# EAGLE design remoteserialcontroller (EAGLE 9.5.2)
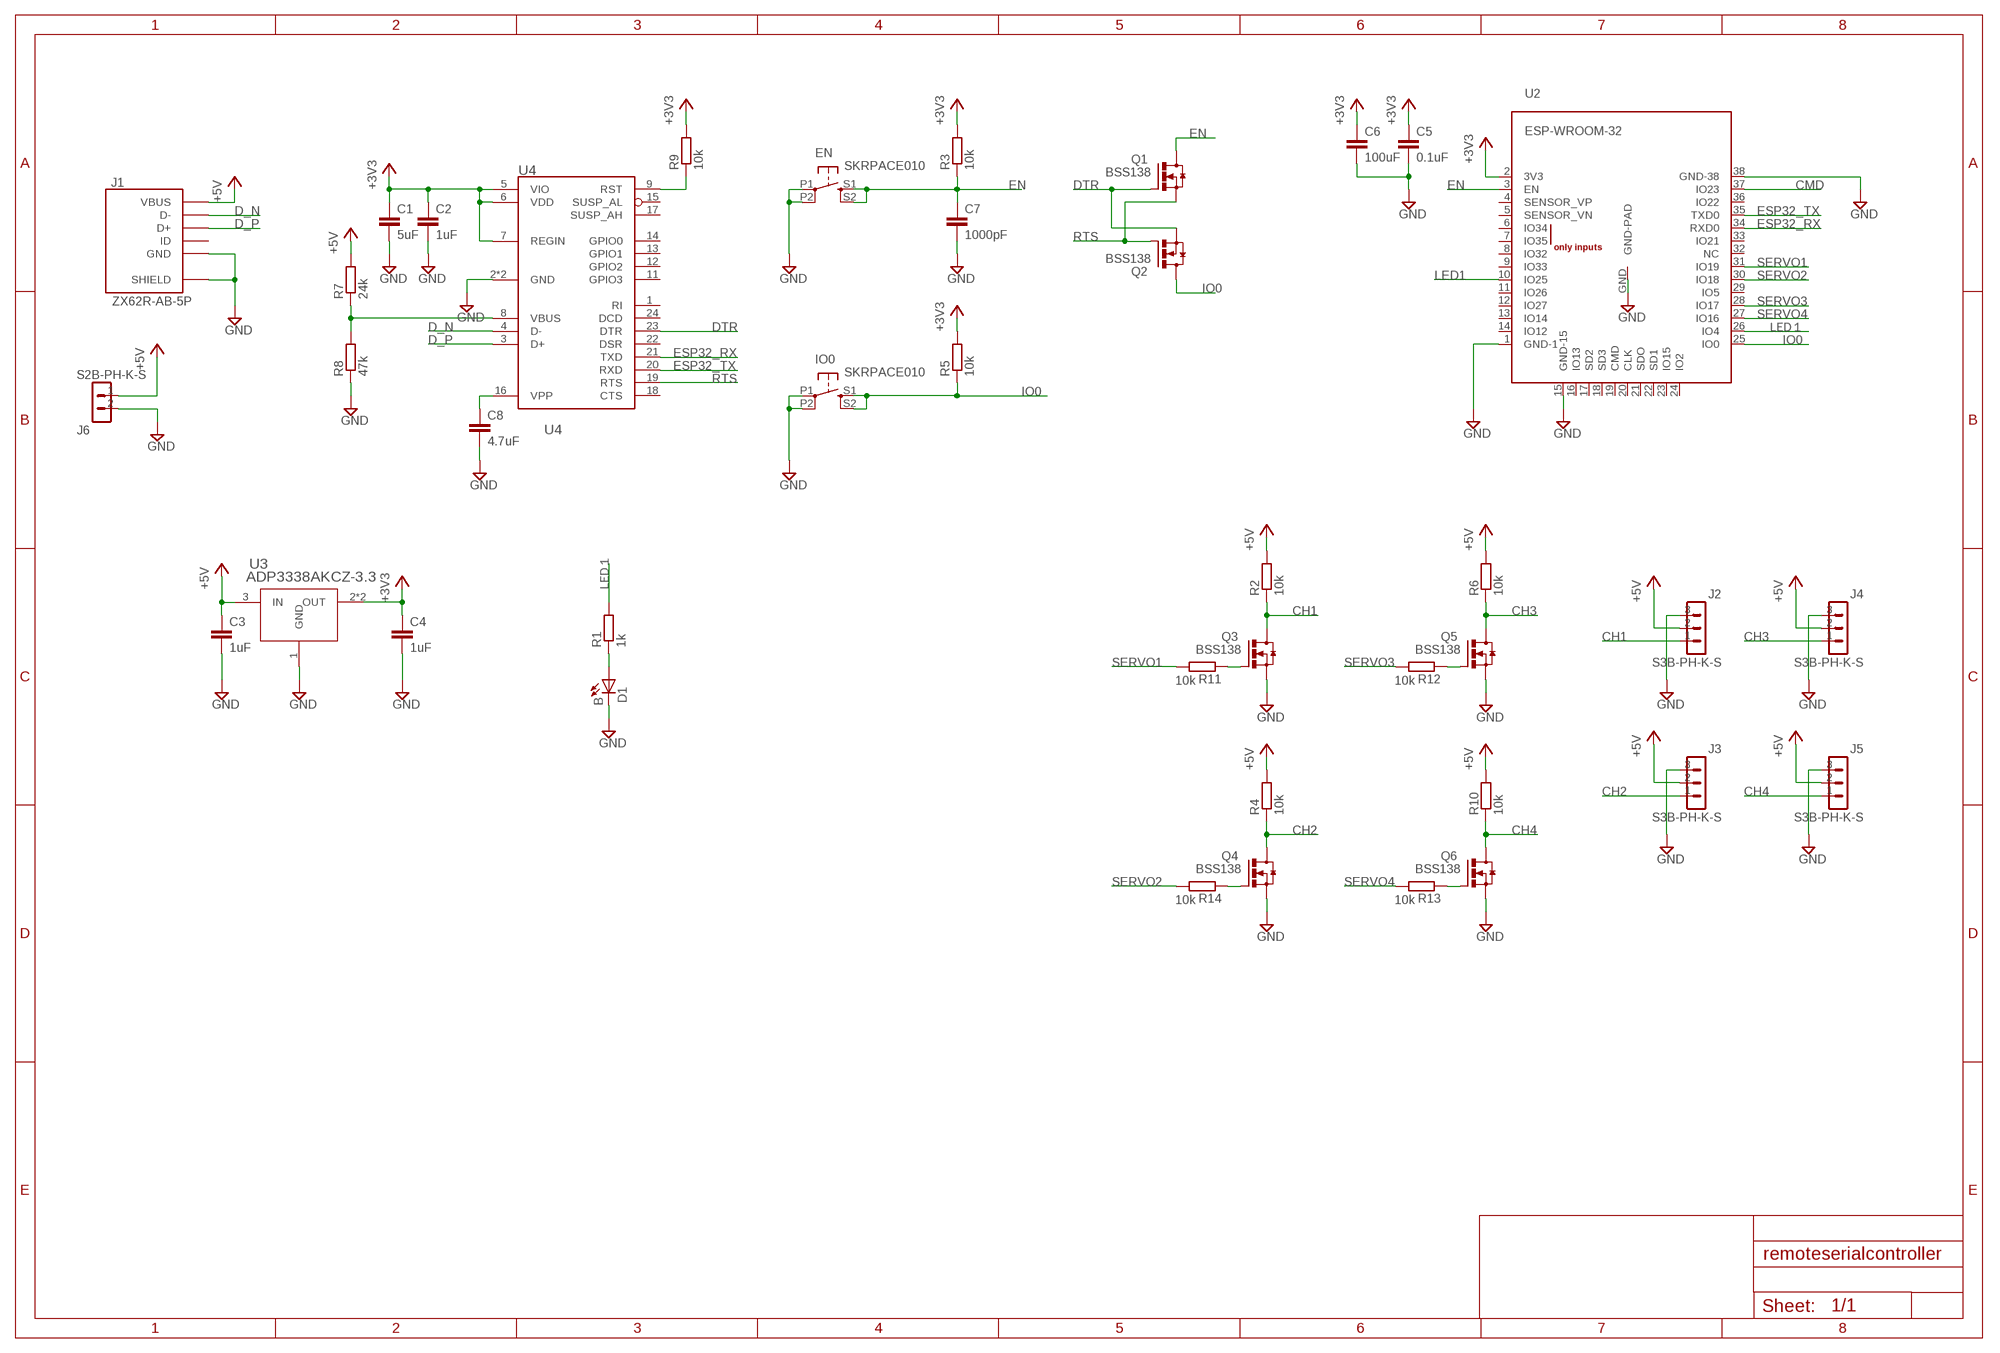
[diagram p0: schematic, sheet 1]

## Parts
C1  5uF  C-EUC0603  [C0603]
C2  1uF  C-EUC0603  [C0603]
C3  1uF  C-EUC0603  [C0603]
C4  1uF  C-EUC0603  [C0603]
C5  0.1uF  C-EUC0603  [C0603]
C6  100uF  C-EUC1210  [C1210]
C7  1000pF  C-EUC0603  [C0603]
C8  4.7uF  C-EUC0603  [C0603]
D1  B  LEDCHIPLED_0603  [CHIPLED_0603]
EN  SKRPACE010  [SKRPACE010]
IO0  SKRPACE010  [SKRPACE010]
J1  ZX62R-AB-5P  [ZX62R-B-5PA]
J2  S3B-PH-K-S  [S3B-PH-K-S]
J3  S3B-PH-K-S  [S3B-PH-K-S]
J4  S3B-PH-K-S  [S3B-PH-K-S]
J5  S3B-PH-K-S  [S3B-PH-K-S]
J6  S2B-PH-K-S  [S2B-PH-K-S]
Q1  BSS138  [SOT23-N-MOSFET]
Q2  BSS138  [SOT23-N-MOSFET]
Q3  BSS138  [SOT23-N-MOSFET]
Q4  BSS138  [SOT23-N-MOSFET]
Q5  BSS138  [SOT23-N-MOSFET]
Q6  BSS138  [SOT23-N-MOSFET]
R1  1k  R-EU_R0603  [R0603]
R2  10k  R-EU_R0603  [R0603]
R3  10k  R-EU_R0603  [R0603]
R4  10k  R-EU_R0603  [R0603]
R5  10k  R-EU_R0603  [R0603]
R6  10k  R-EU_R0603  [R0603]
R7  24k  R-EU_R0603  [R0603]
R8  47k  R-EU_R0603  [R0603]
R9  10k  R-EU_R0603  [R0603]
R10  10k  R-EU_R0603  [R0603]
R11  10k  R-EU_R0603  [R0603]
R12  10k  R-EU_R0603  [R0603]
R13  10k  R-EU_R0603  [R0603]
R14  10k  R-EU_R0603  [R0603]
U2  ESP-WROOM-32  [ESP-WROOM-32]
U3  ADP3338AKCZ-3.3  [SOT233]
U4  CP2104  [QFN24-SILABS]

## Nets
+3V3 [POWER]: C1.1 C2.1 C4.1 C5.1 C6.1 R3.2 R5.2 R9.2 U2.2(3V3) U3.2(OUT) U3.4(OUT) U4.5(VIO) U4.6(VDD) U4.7(REGIN)
+5V: C3.1 J1.VCC(VBUS) J2.2 J3.2 J4.2 J5.2 J6.1 R2.2 R4.2 R6.2 R7.2 R10.2 U3.3(IN)
CH1: J2.1 Q3.D R2.1
CH2: J3.1 Q4.D R4.1
CH3: J4.1 Q5.D R6.1
CH4: J5.1 Q6.D R10.1
CMD: U2.37(IO23)
D_N: J1.D- U4.4(D-)
D_P: J1.D+ U4.3(D+)
DTR: Q1.G Q2.S U4.23(DTR)
EN: C7.1 EN.S1(S) EN.S2(S1) Q1.D R3.1 U2.3(EN)
ESP32_RX: U2.34(RXD0) U4.21(TXD)
ESP32_TX: U2.35(TXD0) U4.20(RXD)
GND: C1.2 C2.2 C3.2 C4.2 C5.2 C6.2 C7.2 C8.2 D1.C EN.P1(P) EN.P2(P1) IO0.P1(P) IO0.P2(P1) J1.GND J1.SHIELD@1(SHIELD) J1.SHIELD@2(SHIELD) J1.SHIELD@3(SHIELD) J1.SHIELD@4(SHIELD) J2.3 J3.3 J4.3 J5.3 J6.2 Q3.S Q4.S Q5.S Q6.S R8.1 U2.1(GND-1) U2.15(GND-15) U2.38(GND-38) U2.GND(GND-PAD) U3.1(GND) U4.2(GND) U4.25(GND)
IO0: IO0.S1(S) IO0.S2(S1) Q2.D R5.1 U2.25(IO0)
LED1: U2.10(IO25)
LED１: R1.2 U2.26(IO4)
N$1: Q3.G R11.1
N$2: Q5.G R12.1
N$3: Q6.G R13.1
N$4: Q4.G R14.1
N$7: R9.1 U4.9(RST)
N$8: R7.1 R8.2 U4.8(VBUS)
N$9: C8.1 U4.16(VPP)
N$94: D1.A R1.1
RTS: Q1.S Q2.G U4.19(RTS)
SERVO1: R11.2 U2.31(IO19)
SERVO2: R14.2 U2.30(IO18)
SERVO3: R12.2 U2.28(IO17)
SERVO4: R13.2 U2.27(IO16)
Unconnected: J1.ID U2.4(SENSOR_VP) U2.5(SENSOR_VN) U2.6(IO34) U2.7(IO35) U2.8(IO32) U2.9(IO33) U2.11(IO26) U2.12(IO27) U2.13(IO14) U2.14(IO12) U2.16(IO13) U2.17(SD2) U2.18(SD3) U2.19(CMD) U2.20(CLK) U2.21(SDO) U2.22(SD1) U2.23(IO15) U2.24(IO2) U2.29(IO5) U2.32(NC) U2.33(IO21) U2.36(IO22) U4.1(RI) U4.11(GPIO3) U4.12(GPIO2) U4.13(GPIO1) U4.14(GPIO0) U4.15(SUSP_AL) U4.17(SUSP_AH) U4.18(CTS) U4.22(DSR) U4.24(DCD)

## Library data of the parts
C1-C8 = taki-library:C-EU: CAPACITOR, European symbol
D1 = taki-library:LED: LED OSRAM: - CHIPLED LG R971, LG N971, LY N971, LG Q971, LY Q971, LO R971, LY R971 LH N974, LH R974 LS Q976, LO Q976, LY Q976 LO Q996 - Hyper CHIPLED LW Q18S LB Q993, LB Q99A, LB R99A - SideLED LS A670, LO A670, LY A670, LG A670, LP A670 LB A673, LV A673, LT A673, LW A673 LH A674 LY A675 LS A676, LA A676, LO A676, LY A676, LW A676 LS A679, LY A679, LG A679 - Hyper Micro SIDELED® LS Y876, LA Y876, LO Y876, LY Y876 LT Y87S - SmartLED LW L88C, LW L88S LB L89C, LB L89S, LG L890 LS L89K, LO L89K, LY L89K LS L896, LA L896, LO L896, LY L896 - TOPLED LS T670, LO T670, LY T670, LG T670, LP T670 LSG T670, LSP T670, LSY T670, LOP T670, LYG T670 LG T671, LOG T671, LSG T671 LB T673, LV T673, LT T673, LW T673 LH T674 LS T676, LA T676, LO T676, LY T676, LB T676, LH T676, LSB T676, LW T676 LB T67C, LV T67C, LT T67C, LS T67K, LO T67K, LY T67K, LW E67C LS E67B, LA E67B, LO E67B, LY E67B, LB E67C, LV E67C, LT E67C LW T67C LS T679, LY T679, LG T679 LS T770, LO T770, LY T770, LG T770, LP T770 LB T773, LV T773, LT T773, LW T773 LH T774 LS E675, LA E675, LY E675, LS T675 LS T776, LA T776, LO T776, LY T776, LB T776 LHGB T686 LT T68C, LB T68C - Hyper Mini TOPLED® LB M676 - Mini TOPLED Santana® LG M470 LS M47K, LO M47K, LY M47K Source: http://www.osram.convergy.de LUXEON: - LUMILED® LXK2-PW12-R00, LXK2-PW12-S00, LXK2-PW14-U00, LXK2-PW14-V00 LXK2-PM12-R00, LXK2-PM12-S00, LXK2-PM14-U00 LXK2-PE12-Q00, LXK2-PE12-R00, LXK2-PE12-S00, LXK2-PE14-T00, LXK2-PE14-U00 LXK2-PB12-K00, LXK2-PB12-L00, LXK2-PB12-M00, LXK2-PB14-N00, LXK2-PB14-P00, LXK2-PB14-Q00 LXK2-PR12-L00, LXK2-PR12-M00, LXK2-PR14-Q00, LXK2-PR14-R00 LXK2-PD12-Q00, LXK2-PD12-R00, LXK2-PD12-S00 LXK2-PH12-R00, LXK2-PH12-S00 LXK2-PL12-P00, LXK2-PL12-Q00, LXK2-PL12-R00 Source: www.luxeon.com KINGBRIGHT: KA-3528ASYC Source: www.kingbright.com
EN IO0 = taki-library:SKRPACE010
J1 = taki-library:ZX62
J2-J5 = taki-library:S3B-PH-K-S
J6 = taki-library:S2B-PH-K-S
Q1-Q6 = taki-library:BSS138
R1-R14 = taki-library:R-EU_: RESISTOR, European symbol
U2 = taki-library:ESP-WROOM-32
U3 = taki-library:ADP3338AKCZ-3.3
U4 = taki-library:CP2104

## Net classes
0 default: width 0.152 mm
1 POWER: width 0.254 mm

## Board
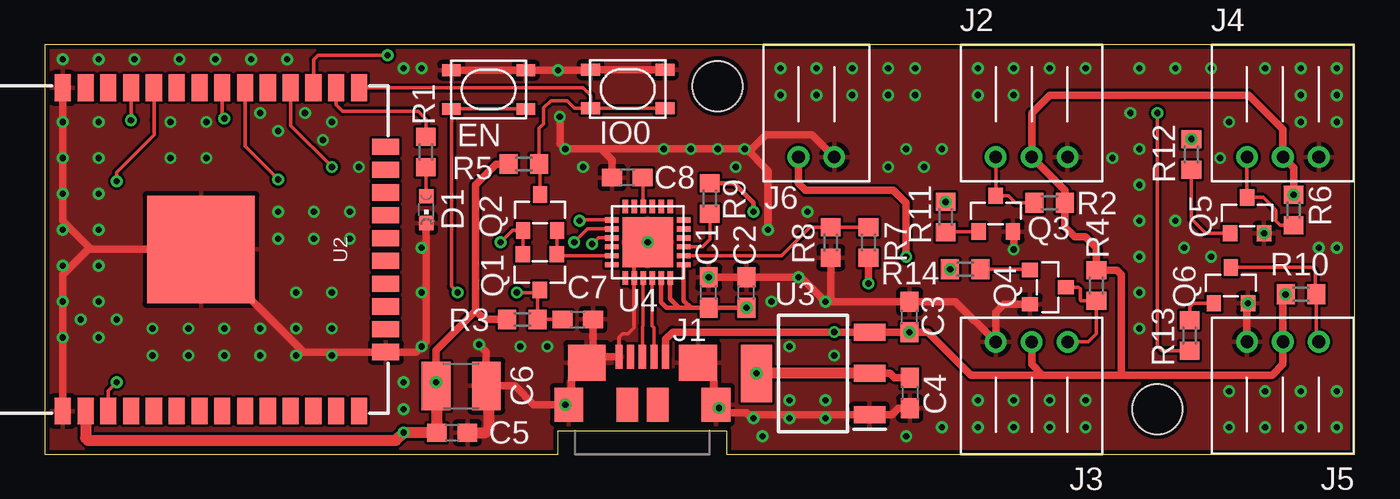
[diagram p1: board, top side]
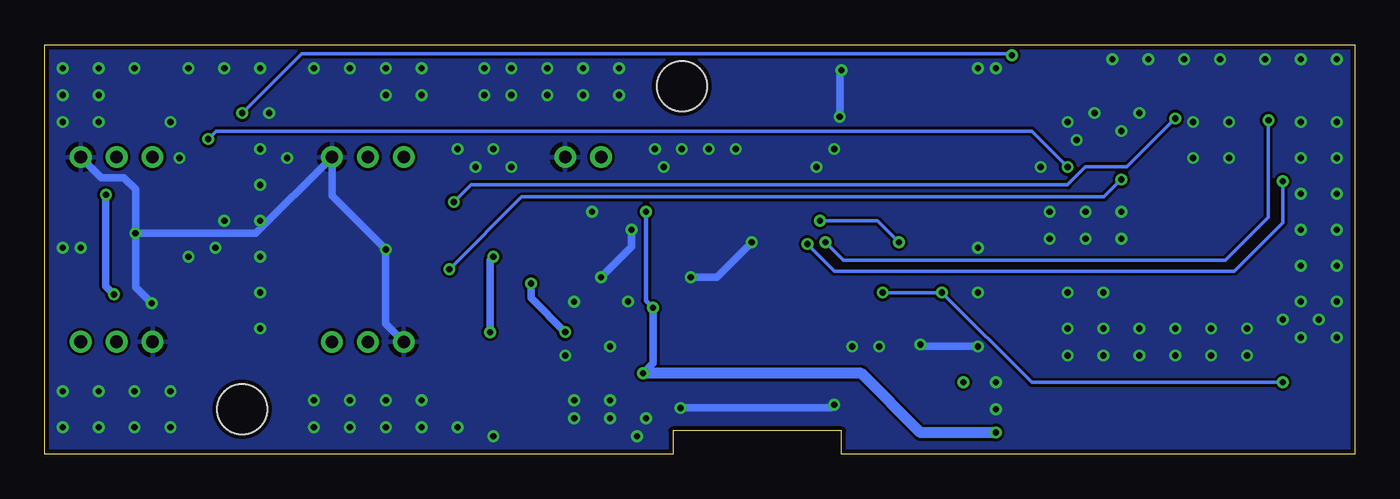
[diagram p2: board, bottom side, seen from below]

Size 73 x 22.8 mm. Coordinates in mm from the lower left corner, seen from the top.
Outline: 0,0 28.6,0 28.6,1.3 38,1.3 38,0 73,0 73,22.8 0,22.8 0,0
Copper layers (1*16): Top 0.035mm / dielectric 1.5mm / Bottom 0.035mm
Design rules "Elecrow_2-layer_eagle_rule": minimum track width 6mil, minimum drill 12mil, track to track 6mil, track to pad 6mil, pad to pad 6mil, via to via 6mil, smd to smd 0mil, copper to edge 10mil, drill to drill 10mil, minimum pad ring 10mil, minimum via ring 6mil, stop-mask expansion 2mil, vias tented up to drill 100mil, thermal gap 10mil
Holes 2.8 mm at 37.5,20.5 62,2.5

### Footprints (pad centres in the part's own frame; a part is rotated, then mirrored left to right if it is on the bottom)
C0603 = smd 1.1 x 1: 1 -0.85,0; 2 0.85,0
C1210 = smd 1.6 x 2.7: 1 -1.4,0; 2 1.4,0
CHIPLED_0603 = smd 0.8 x 0.8: A 0,-0.75; C 0,0.75
SKRPACE010 = smd 1.05 x 0.65: P1 -2.075,-1.075; P2 2.075,-1.075; S1 -2.075,1.075; S2 2.075,1.075
ZX62R-B-5PA = smd 0.4 x 1.35: D+ 0,2.675; D- 0.65,2.675; GND -1.3,2.675; ID -0.65,2.675; VCC 1.3,2.675 | smd 1.2 x 1.9: NC@1 -0.85,0; NC@2 0.85,0 | smd 2.1 x 2: SHIELD@1 -3.1,2.35; SHIELD@2 3.1,2.35 | smd 1.6 x 1.9: SHIELD@3 -4.1,0; SHIELD@4 4.1,0
S3B-PH-K-S = drill 0.7: 1 -2,0; 2 0,0; 3 2,0
S2B-PH-K-S = drill 0.7: 1 -1,0; 2 1,0
SOT23-N-MOSFET = smd 0.8 x 0.9: D 0,1; G -0.95,-1; S 0.95,-1
R0603 = smd 1 x 1.1: 1 -0.85,0; 2 0.85,0
ESP-WROOM-32 = smd 0.9 x 1.5: 1 7.7,9; 2 6.43,9; 3 5.16,9; 4 3.89,9; 5 2.62,9; 6 1.35,9; 7 0.08,9; 8 -1.19,9; 9 -2.46,9; 10 -3.73,9; 11 -5,9; 12 -6.27,9; 13 -7.54,9; 14 -8.81,9; 25 -8.81,-9; 26 -7.54,-9; 27 -6.27,-9; 28 -5,-9; 29 -3.73,-9; 30 -2.46,-9; 31 -1.19,-9; 32 0.08,-9; 33 1.35,-9; 34 2.62,-9; 35 3.89,-9; 36 5.16,-9; 37 6.43,-9; 38 7.7,-9 | smd 1.5 x 0.9: 15 -10.3,5.715; 16 -10.3,4.445; 17 -10.3,3.175; 18 -10.3,1.905; 19 -10.3,0.635; 20 -10.3,-0.635; 21 -10.3,-1.905; 22 -10.3,-3.175; 23 -10.3,-4.445; 24 -10.3,-5.715 | smd 6 x 6: GND 0,0
SOT233 = smd 1.75 x 0.95: 1 -3.15,2.3; 2 -3.15,0; 3 -3.15,-2.3 | smd 1.75 x 3.2: 4 3.15,0
QFN24-SILABS = smd 0.75 x 0.3: 1 -2,1.25; 2 -2,0.75; 3 -2,0.25; 4 -2,-0.25; 5 -2,-0.75; 6 -2,-1.25; 13 2,-1.25; 14 2,-0.75; 15 2,-0.25; 16 2,0.25; 17 2,0.75; 18 2,1.25 | smd 0.3 x 0.75: 7 -1.25,-2; 8 -0.75,-2; 9 -0.25,-2; 10 0.25,-2; 11 0.75,-2; 12 1.25,-2; 19 1.25,2; 20 0.75,2; 21 0.25,2; 22 -0.25,2; 23 -0.75,2; 24 -1.25,2 | smd 2.8 x 2.8: 25 0,0

### Placement (x,y rotation side)
C1  37,9 90 top
C2  39.1,9 90 top
C3  48.19,7.64 90 top
C4  48.21,3.41 270 top
C5  22.7,1.2 0 top
C6  23.2,3.8 0 top
C7  29.7,7.5 0 top
C8  32.46,15.41 180 top
D1  21.26,13.62 180 top
EN  24.73,20.31 180 top
IO0  32.49,20.34 180 top
J1  33.3,2.75 0 top
J2  55,16.55 0 top
J3  55,6.25 180 top
J4  69,16.55 0 top
J5  69,6.26 180 top
J6  43,16.55 0 top
Q1  27.59,10.14 180 top
Q2  27.6,13.46 0 top
Q3  53,13.4 0 top
Q4  55.9,9.3 270 top
Q5  67,13.3 0 top
Q6  66.1,9.4 0 top
R1  21.24,16.84 90 top
R2  56,14 0 top
R3  26.6,7.5 180 top
R4  58.6,9.4 90 top
R5  26.7,16.16 180 top
R6  69.6,13.6 90 top
R7  45.9,11.8 270 top
R8  43.8,11.8 90 top
R9  37.06,14.24 90 top
R10  70,8.9 180 top
R11  50.2,13.2 90 top
R12  63.9,16.7 90 top
R13  63.8,6.6 270 top
R14  51.3,10.3 180 top
U2  8.7,11.4 180 top
U3  42.81,4.5 180 top
U4  33.6,11.8 90 top

### Tracks (layer width: path | path; a pad name or v marks a point on that pad's centre or on a via)
+3V3  (via drill 0.35)
  Top 0.254: U4.6 34.85,8.65 35.35,8.15 | 35.35,8.15 36,8.15 | 36,8.15 C1.1 C2.1 | U4.7 35.6,8.55 36,8.15 | U4.5 34.35,8.45 34.65,8.15 35.35,8.15 | R9.2 38.41,15.09 39.5,14 v39.5,13.5
  Top 0.406: U3.2 47.1,4.5 47.34,4.26 C4.1 | R3.2 24.5,7.5 24,8 | 24,8 24,15 25.16,16.16 R5.2 | v21.8,4 21.8,5.8 24,8
  Top 0.61: U2.2 2.27,0.91 2.41,0.76 19.56,0.76 v20,1.2 C5.1 21.85,3.85 C6.1 v21.8,4 | U3.2 U3.4
  Bottom 0.254: v39.5,13.5 39.5,8.55 C2.1
  Bottom 0.406: C2.1 39.1,5.06 U3.4
  Bottom 0.61: v20,1.2 24.2,1.2 27.5,4.5 U3.4
  other vias: 39.1,8.15 39.66,4.5
+5V  (via drill 0.35)
  Top 0.406: J1.VCC 34.6,6.4 35,6.8 v44,6.8 U3.3 C3.1 49.21,6.79 51.6,4.4 55.6,4.4 | v45.9,9.5 R7.2 | J6.1 42,15.1 42.4,14.7 47.3,14.7 48,14 v48,11 | R6.2 69.6,15.95 J4.2 69,18.1 67.1,20 56,20 55,19 J2.2 56.85,14.7 R2.2 56.85,12.65 57.4,12.1 58,12.1 58.6,11.5 R4.2 59.75,10.25 60,10 60,4.4 | R10.2 69,8.75 J5.2 69,5 68.4,4.4 60,4.4 | J3.2 55,5 55.6,4.4 | 55.6,4.4 60,4.4
  Bottom 0.406: v45.9,9.5 45.9,8.7 v44,6.8 | C3.1 48.19,10.81 v48,11 | R10.2 69.6,9.35 R6.2
  other vias: 48.19,6.79 69.15,8.9 69.6,14.45
CH1
  Top 0.203: J2.1 Q3.D 53.7,14.4 54.1,14 R2.1
CH2
  Top 0.203: Q4.D 57.6,9.3 57.7,9.2 57.7,8.6 57.75,8.55 R4.1 58.6,6.7 58.15,6.25 J3.1
CH3
  Top 0.203: Q5.D 67.05,14.25 | Q5.D J4.1 | 69.25,12.75 R6.1 68.85,12.75 68.6,13 68.6,13.6 67.9,14.3 Q5.D
CH4
  Top 0.203: J5.1 70.85,6.41 R10.1 70.8,8.95 70.8,10.2 70.6,10.4 Q6.D
D_N
  Top 0.203: U4.4 33.85,7.15 33.95,7.05 J1.D-
D_P
  Top 0.203: U4.3 33.35,7.15 33.3,7.1 J1.D+
DTR
  Top 0.203: U4.23 28.63,11.05 Q1.G Q2.S
EN  (via drill 0.35)
  Top 0.203: 27.45,9 R3.1 C7.1 | v4,4 3.54,3.54 U2.3 | Q1.D 27.45,9 | 27.45,9 v26.3,9 | EN.S1 EN.S2 22.66,9.35 v23,9
  Bottom 0.203: v4,4 18,4 v23,9 v26.3,9
ESP32_RX  (via drill 0.35)
  Top 0.203: U2.34 6.08,18.62 | 6.08,18.62 6.1,18.6 | 6.08,18.62 6.08,17.78 4,15.7 v4,15.2 | v30.5,11.7 30.85,12.05 U4.21
  Bottom 0.203: v4,15.2 4,12.9 6.7,10.2 29,10.2 v30.5,11.7
ESP32_TX  (via drill 0.35)
  Top 0.203: U4.20 30.25,12.55 v29.5,11.8 | v4.8,18.6 U2.35
  Bottom 0.203: v29.5,11.8 28.5,10.8 7.2,10.8 4.8,13.2 v4.8,18.6
GND  (via drill 0.35)
  Top 0.203: J1.GND 32,6.5 32.2,6.7 32.5,6.7 32.85,7.05 U4.2 32.85,11.05 U4.25 | 37.25,2 37.4,2.15 J1.SHIELD@4 v37.58,2.58
  Top 0.406: J1.SHIELD@1 30.05,4.95 29.47,4.95 29.35,4.83 29.35,2 | 37.25,2 37.25,4.83 37.13,4.95 36.55,4.95 J1.SHIELD@2 | J1.GND 30.52,5.42 J1.SHIELD@1 | v37.58,2.58 37.85,2.3 39.1,2.3 39.2,2.2 U3.1 47.2,2.2 47.56,2.56 C4.2 | C1.2 C2.2 v42,9.85 42.15,9.85 v43.51,8.49 | v43.51,8.49 C3.2 50.76,8.49 J3.3 53,7.9 53.45,8.35 Q4.S | R8.1 43.8,8.78 v43.51,8.49 | 22.62,21.41 EN.P2 EN.P1 v28.6,21.39 30.39,21.39 IO0.P2 IO0.P1 | C8.2 31.61,16.39 31,17 | 31,17 v29,17 28.7,17.3 v28.7,18.8 | J1.SHIELD@1 30.55,5.45 C7.2 | J1.SHIELD@3 v29,2.75 27.25,2.75 26.2,3.8 C6.2 24.6,5.7 v24.2,6.1 | J5.3 67,8.35 Q6.S | U2.38 1,13 2.5,11.5 | 2.5,11.5 2.6,11.4 U2.GND 14.41,5.68 U2.15 20.68,5.68 v21,6 21.26,6.26 D1.C | U2.1 1,10 2.5,11.5 | v40.3,12.5 40.3,15.8 39.1,17 | 31,17 39.1,17 | 39.1,17 39.4,17 40.2,17.8 42.75,17.8 J6.2 | Q3.S 54,12.35 v54,11.4
  Top 0.61: C5.2 24.57,1.2 24.77,1.4 24.77,3.73 C6.2
  Bottom 0.406: U4.25 35.55,9.85 C1.2 | v28.6,21.39 28.7,21.29 v28.7,18.8 | v37.58,2.58 29.18,2.58 v29,2.75 | Q6.S 67.95,9.3 Q5.S | J4.3 69.85,15.4 68.6,15.4 67.95,14.75 Q5.S | v24.2,6.1 24.1,6 v21,6 | v42,9.85 40.3,11.55 v40.3,12.5 | J3.3 54,7.25 v54,11.4 57,14.4 J2.3 61.25,12.3 Q5.S
  other vias: 33.6,11.8 37,9.85 67.05,8.4 67.95,12.3 1,18.5 1,16.5 3,16.5 3,18.5 1,14.5 3,14.5 1,12.5 3,12.5 1,10.5 3,10.5 1,8.5 3,8.5 2,7.5 4,7.5 1,6.5 3,6.5 7,18.5 9,18.5 9,16.5 7,16.5 6,7 8,7 6,5.5 8,5.5 10,7 10,5.5 12,5.5 12,7 14,7 14,5.5 13,13.5 13,12 15,12 15,13.5 17,13.5 17,12 16,7 16,5.5 14,9 16,9 21,9 21,11.5 30,16 34.5,17 36,17 37.5,17 39,17 41,21.5 41,20 43,21.5 43,20 45,21.5 45,20 47,21.5 47,20 48.5,21.5 48.5,20 52,21.5 52,20 54,21.5 54,20 56,21.5 58,21.5 61,21.5 63,21.5 65,21.5 68,21.5 70,21.5 70,20 72,21.5 72,20 72,18.5 70,18.5 66,18.5 72,11.5 71,11.5 63.5,11.5 63,13 61,17 61,15 61,13 61,11 61,9 61,7 70,3.5 70,1.5 68,1.5 68,3.5 66,3.5 66,1.5 72,1.5 72,3.5 58,3 58,1.5 56,1.5 56,3 54,3 54,1.5 52,1.5 52,3 50,1.5 41.5,3 43.5,3 43.5,2 41.5,2 39.5,2 40,1 48,1 41.5,6 44,5.5 40.5,8.5 42.5,13.5 38.5,16 47,16 49,16 48,17 50,17 20,21.5 21,21.5 13.5,22 11.5,22 9.5,22 7.5,22 5,22 3,22 1,22 12,19 13,18 14.5,19 16,18.5 15.5,17.5 17.5,16 20,4 20,2.5 26.5,6 28,6 60.5,19 59.5,16.5 65.5,16.5 65,11
  pour Top: 0,23 0,0 73,0 73,23
  pour Bottom: -0.5,23 -0.5,0 73,0 73,23
IO0
  Top 0.203: Q2.D 27.6,16.11 R5.1 | 27.57,16.18 R5.1 | IO0.S2 30.41,19.98 30,20.4 U2.25 | IO0.S2 IO0.S1 | R5.1 27.55,18.15 27.8,18.4 27.8,19.3 28.2,19.7 29.1,19.7 29.54,19.27 IO0.S2
LED１
  Top 0.203: R1.2 21.24,18.66 20.8,19.1 16.6,19.1 16.24,19.46 U2.26
N$1
  Top 0.203: Q3.G 50.25,12.4 R11.1
N$2
  Top 0.203: R12.1 63.9,13.1 64.7,12.3 Q5.G
N$3
  Top 0.203: R13.1 63.8,8.2 64,8.4 Q6.G
N$4
  Top 0.203: R14.1 54.85,10.3 Q4.G
N$7
  Top 0.203: U4.9 36.65,11.55 37.06,11.96 R9.1
N$8
  Top 0.203: R7.1 R8.2 42.65,12.65 41.05,11.05 U4.8
N$9
  Top 0.203: U4.16 33.35,15.35 C8.1
N$94
  Top 0.203: D1.A 21.24,14.39 R1.1
RTS  (via drill 0.35)
  Top 0.203: U4.19 29.85,13.05 v29.8,13 | v25.4,11.8 26.06,12.46 Q2.G Q1.S
  Bottom 0.203: v29.8,13 26.6,13 v25.4,11.8
SERVO1  (via drill 0.35)
  Top 0.203: v10,18.7 9.89,18.81 U2.31
  Bottom 0.203: v10,18.7 12.7,16 15,16 16,15 49.25,15 R11.2
  other vias: 50.2,14.05
SERVO2  (via drill 0.35)
  Top 0.203: U2.30 11.16,17.14 v13,15.3
  Bottom 0.203: v13,15.3 13.97,14.33 46.42,14.33 R14.2
  other vias: 50.45,10.3
SERVO3  (via drill 0.35)
  Top 0.203: U2.28 13.7,18.3 v16,16
  Bottom 0.203: v16,16 18,18 63.45,18 R12.2
  other vias: 63.9,17.55
SERVO4  (via drill 0.35)
  Top 0.203: R13.2 62.25,5.75 62,6 v62,19 | v19.1,22.22 15.22,22.22 14.97,21.97 U2.27
  Bottom 0.203: v62,19 58.68,22.32 19.2,22.32 v19.1,22.22